# Altium schematic sheet 5V_Power_Stage.SchDoc (part 1 of 3)
size 431 x 279 mm; Organization: ORGANIZATION; Address1: ADDRESS 1; Address2: ADDRESS 2; Address3: ADDRESS 3; Address4: ADDRESS 4; Revision: -; SheetNumber: 5; SheetTotal: 6; ENG_APP_DATE: --/--/--; DSN_APP_DATE: --/--/--; CHK_APP_DATE: --/--/--
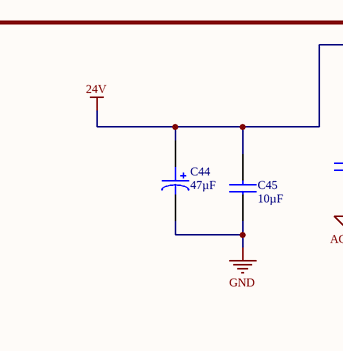
[diagram p0: 5V_Power_Stage.SchDoc, left]
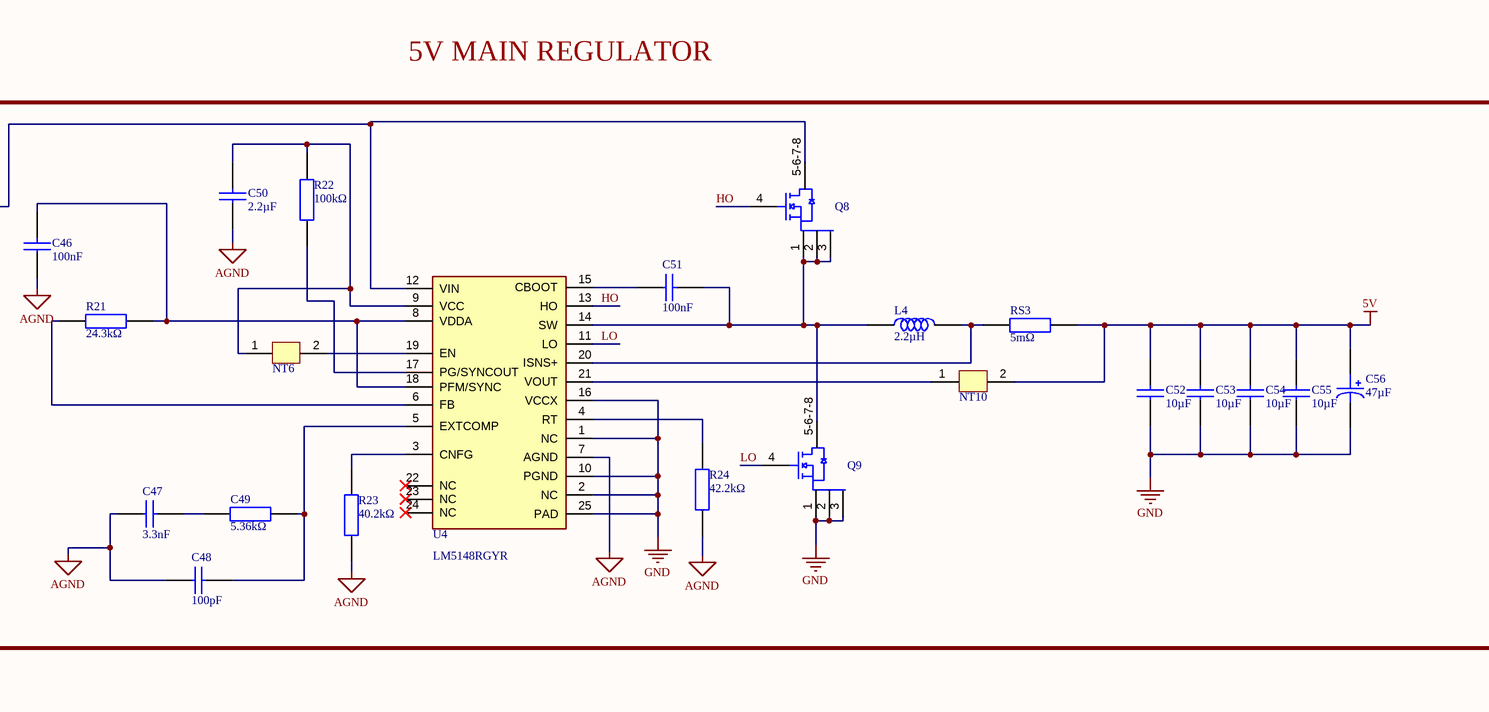
[diagram p1: 5V_Power_Stage.SchDoc, right]

## Parts
C44  value 47µF  [CAP ALUM SMD]  (hidden comment: EEHZA1H470P)
C45  value 10µF  [CAP_1206]  (hidden comment: C3216X7R1H106K160AC)
C46  value 100nF  [CAP_0402]  (hidden comment: GRM155R71A104KA01D)
C47  value 3.3nF  [CAP_0805]  (hidden comment: CGA4C2C0G1H332J060AA)
C48  value 100pF  [CAP_0805]  (hidden comment: CL21C101JBANNNC)
C49  value 5.36kΩ  [RES_0402]  (hidden comment: CRCW04025K36FKED)
C50  value 2.2µF  [CAP_0603]  (hidden comment: GRM188R71A225KE15D)
C51  value 100nF  [CAP_0402]  (hidden comment: GRM155R71A104KA01D)
C52  value 10µF  [CAP_1206]  (hidden comment: GRM31CR71E106KA12L)
C53  value 10µF  [CAP_1206]  (hidden comment: GRM31CR71E106KA12L)
C54  value 10µF  [CAP_1206]  (hidden comment: GRM31CR71E106KA12L)
C55  value 10µF  [CAP_1206]  (hidden comment: GRM31CR71E106KA12L)
C56  value 47µF  [CAP ALUM SMD]  (hidden comment: EEHZA1H470P)
L4  value 2.2µH  [XAL7070]  (hidden comment: XAL7070-222MEC)
NT6  Net-Tie  [Net-Tie]  (value not drawn)  (net tie, no BOM)
NT10  Net-Tie  [Net-Tie]  (value not drawn)  (net tie, no BOM)
Q8  CSD18540Q5B  [SON 5X6]  (value not drawn)
Q9  CSD18563Q5A  [SON 5X6]  (value not drawn)
R21  value 24.3kΩ  [RES_0402]  (hidden comment: CRCW040224K3FKED)
R22  value 100kΩ  [RES_0603]  (hidden comment: CRCW0603100KFKEA)
R23  value 40.2kΩ  [RES_0603]  (hidden comment: RC0603FR-0740K2L)
R24  value 42.2kΩ  [RES_0603]  (hidden comment: CRCW060342K2FKEA)
RS3  value 5mΩ  [RES_2010]  (hidden comment: CSNL2010FT5L00)
U4  LM5148RGYR  [VQFN-24]

## Nets
5V: C52.2 C53.2 C54.2 C55.2 C56.1(C) NT10.2 RS3.2
24V: C44.1(C) C45.2 Q8.5-6-7-8(D) U4.12(VIN)
AGND: C46.1 C47.1 C48.1 C50.1 R23.1 R24.1 U4.7(AGND)
GND: C44.2(A) C45.1 C52.1 C53.1 C54.1 C55.1 C56.2(A) Q9.1(S) Q9.2(S) Q9.3(S) U4.1(NC) U4.2(NC) U4.10(PGND) U4.16(VCCX) U4.25(PAD)
HO: Q8.4(G) U4.13(HO)
LO: Q9.4(G) U4.11(LO)
NetC46_2: C46.2 R21.2 U4.8(VDDA) U4.18(PFM/SYNC)
NetC47_2: C47.2 C49.1
NetC48_2: C48.2 C49.2 U4.5(EXTCOMP)
NetC50_2: C50.2 NT6.1 R22.2 U4.9(VCC)
NetC51_1: C51.1 U4.15(CBOOT)
NetC51_2: C51.2 L4.1 Q8.1(S) Q8.2(S) Q8.3(S) Q9.5-6-7-8(D) U4.14(SW)
NetL4_2: L4.2 RS3.1 U4.20(ISNS+)
NetNT6_2: NT6.2 U4.19(EN)
NetNT10_1: NT10.1 U4.21(VOUT)
NetR21_1: R21.1 U4.6(FB)
NetR22_1: R22.1 U4.17(PG/SYNCOUT)
NetR23_2: R23.2 U4.3(CNFG)
NetR24_2: R24.2 U4.4(RT)

Not connected (* = marked no-connect by the designer): U4 22(NC)* 23(NC)* 24(NC)*

## Notes on the sheet
- 5V MAIN REGULATOR
- DWG. NO.
- REV.
- SHT.
- THIS DOCUMENT AND THE DATA DISCLOSED HEREIN OR HEREWITH IS THE PROPERTY OF ALTIUM LIMITED AND MAY BE FREELY DISTRIBUTED IN WHOLE. NO RIGHTS ARE RESERVED OR EXPRESS OR IMPLIED WARANTEE GIVEN.
- REVISION
- DESCRIPTION
- DATE
- APPROVED
- ENG:
- DSN:
- APPROVALS
- PROJECT REVISION:
- www.altium.com <http://www.altium.com>
- DOCUMENT REVISION:
- 92037, La Jolla
- USA
- Altium Ltd.
- 4225 Executive Square
- CHK:
- REFERENCE DOCUMENTS
- DESIGN ITEM:
- TITLE
- VARIANT
- BOM:
- FAB DWG:
- PCB DWG:
- ASSY DWG:
- SCALE:
- SIZE
- B
- CAGE CODE
- FILE NAME
- DWG NO.
- SHEET
- OF
- REV